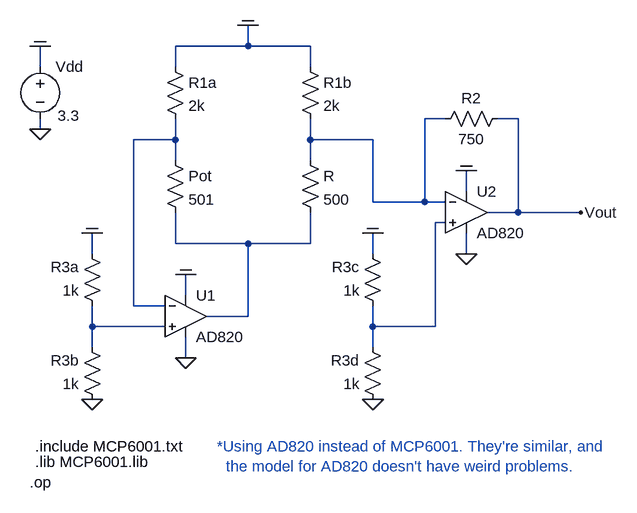
[diagram p0: schematic v1.asc]
v1.asc, the LTspice schematic file:
Version 4
SHEET 1 1188 680
WIRE 0 -48 0 -80
WIRE 0 -48 -112 -48
WIRE 96 -48 0 -48
WIRE -320 -16 -320 -48
WIRE -112 -16 -112 -48
WIRE 96 -16 96 -48
WIRE 304 64 272 64
WIRE 416 64 384 64
WIRE -320 80 -320 64
WIRE -112 96 -112 64
WIRE -112 96 -176 96
WIRE 96 96 96 64
WIRE 192 96 96 96
WIRE -112 128 -112 96
WIRE 96 128 96 96
WIRE 336 176 336 144
WIRE 192 192 192 96
WIRE 272 192 272 64
WIRE 272 192 192 192
WIRE 304 192 272 192
WIRE 416 208 416 64
WIRE 416 208 368 208
WIRE 512 208 416 208
WIRE 304 224 288 224
WIRE -112 256 -112 208
WIRE 0 256 -112 256
WIRE 96 256 96 208
WIRE 96 256 0 256
WIRE -240 272 -240 240
WIRE 192 272 192 240
WIRE 336 272 336 240
WIRE -96 336 -96 304
WIRE -176 352 -176 96
WIRE -128 352 -176 352
WIRE 0 368 0 256
WIRE 0 368 -64 368
WIRE -240 384 -240 352
WIRE -128 384 -240 384
WIRE 192 384 192 352
WIRE 288 384 288 224
WIRE 288 384 192 384
WIRE -240 416 -240 384
WIRE 192 416 192 384
WIRE -96 432 -96 400
FLAG -320 80 0
FLAG -240 496 0
FLAG -96 432 0
FLAG 192 496 0
FLAG 336 272 0
FLAG 512 208 Vout
FLAG 0 -80 COM
FLAG -96 304 COM
FLAG 192 240 COM
FLAG -240 240 COM
FLAG 336 144 COM
FLAG -320 -48 COM
DATAFLAG 496 208 ""
SYMBOL res -128 -32 R0
SYMATTR InstName R1a
SYMATTR Value 2k
SYMBOL res 80 -32 R0
SYMATTR InstName R1b
SYMATTR Value 2k
SYMBOL res -128 112 R0
SYMATTR InstName Pot
SYMATTR Value 501
SYMBOL res 80 112 R0
SYMATTR InstName R
SYMATTR Value 500
SYMBOL voltage -320 -32 R0
WINDOW 3 27 91 Left 2
SYMATTR Value 3.3
SYMATTR InstName Vdd
SYMBOL res -224 512 R180
WINDOW 0 36 76 Left 2
WINDOW 3 36 40 Left 2
SYMATTR InstName R3b
SYMATTR Value 1k
SYMBOL res -224 368 R180
WINDOW 0 36 76 Left 2
WINDOW 3 36 40 Left 2
SYMATTR InstName R3a
SYMATTR Value 1k
SYMBOL res 400 48 R90
WINDOW 0 0 56 VBottom 2
WINDOW 3 32 56 VTop 2
SYMATTR InstName R2
SYMATTR Value 750
SYMBOL res 208 512 R180
WINDOW 0 36 76 Left 2
WINDOW 3 36 40 Left 2
SYMATTR InstName R3d
SYMATTR Value 1k
SYMBOL res 208 368 R180
WINDOW 0 36 76 Left 2
WINDOW 3 36 40 Left 2
SYMATTR InstName R3c
SYMATTR Value 1k
SYMBOL OpAmps\\AD820 -96 304 R0
SYMATTR InstName U1
SYMBOL OpAmps\\AD820 336 144 R0
SYMATTR InstName U2
TEXT -328 568 Left 2 !.include MCP6001.txt
TEXT -336 624 Left 2 !.op
TEXT -328 592 Left 2 !.lib MCP6001.lib
TEXT -48 568 Left 2 ;*Using AD820 instead of MCP6001. They're similar, and\n  the model for AD820 doesn't have weird problems.

The netlist it stands for:
* v1.asc
R1a COM N002 2k
R1b COM N001 2k
R§Pot N002 N004 501
R N001 N004 500
Vdd COM 0 3.3
R3b 0 N005 1k
R3a N005 COM 1k
R2 Vout N001 750
R3d 0 N003 1k
R3c N003 COM 1k
XU1 N005 N002 COM 0 N004 AD820  ; pins In+ In- V+ V- OUT
XU2 N003 N001 COM 0 Vout AD820  ; pins In+ In- V+ V- OUT
.include MCP6001.txt
.op
.lib MCP6001.lib
* *Using AD820 instead of MCP6001. They're similar, and
*   the model for AD820 doesn't have weird problems.
.backanno
.end